# EAGLE schematic STM32H750VBT6_ultra (EAGLE 9.6.2)

## Sheet 1 of 6: STM32H750VBT6_ultra
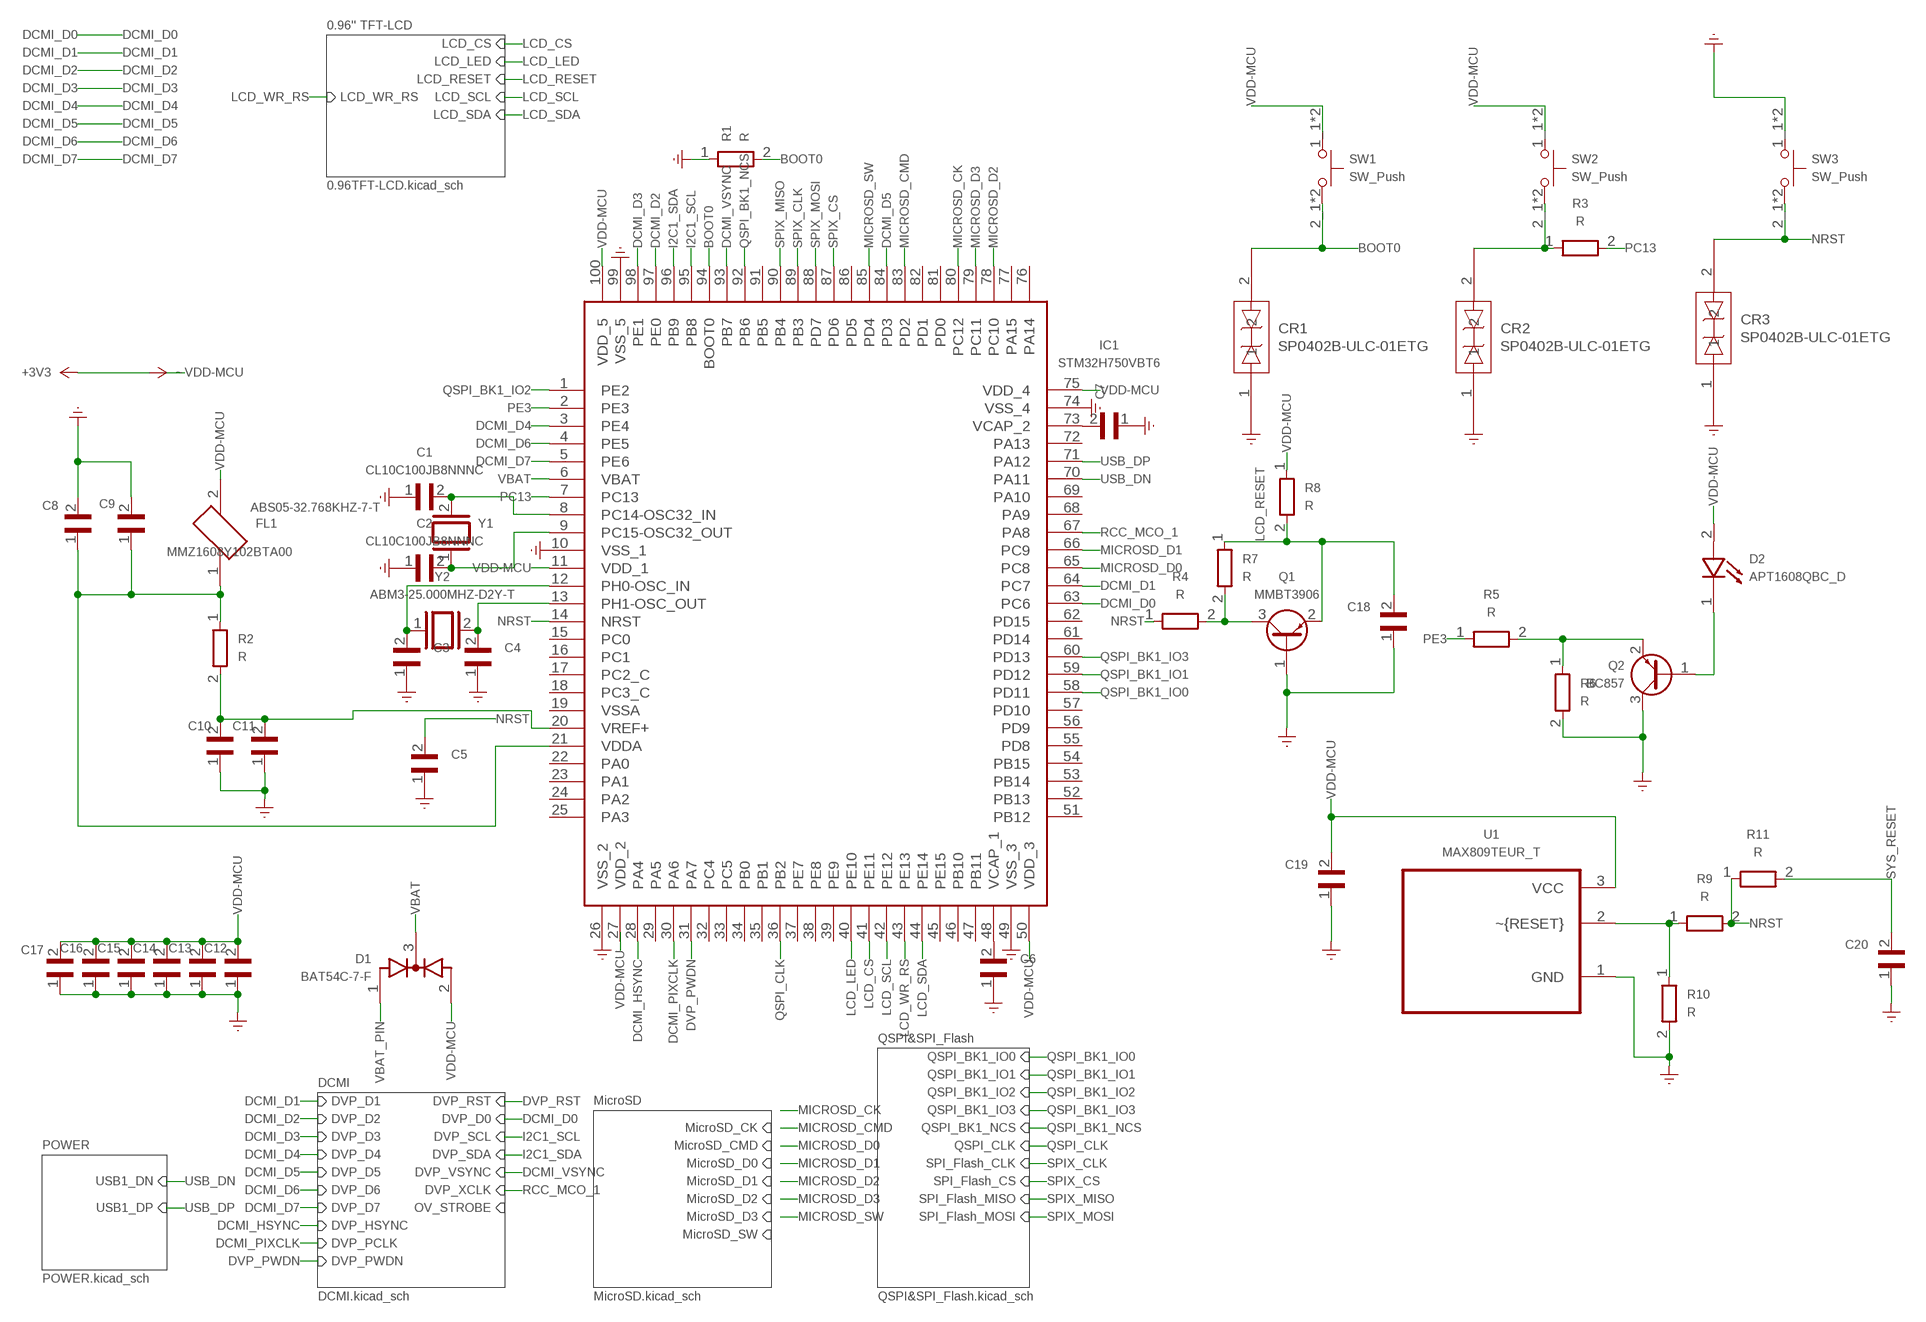
[diagram p0: schematic, sheet 1]

### Parts
C1  CL10C100JB8NNNC  CL10C100JB8NNNCCAPACITOR_SMD_C_0201_0603METRIC  [CAPACITOR_SMD_C_0201_0603METRIC]
C2  CL10C100JB8NNNC  CL10C100JB8NNNCCAPACITOR_SMD_C_0201_0603METRIC  [CAPACITOR_SMD_C_0201_0603METRIC]
C3  CL10C100JB8NNNC  CL10C100JB8NNNCCAPACITOR_SMD_C_0201_0603METRIC  [CAPACITOR_SMD_C_0201_0603METRIC]
C4  CL10C100JB8NNNC  CL10C100JB8NNNCCAPACITOR_SMD_C_0201_0603METRIC  [CAPACITOR_SMD_C_0201_0603METRIC]
C5  CL10C100JB8NNNC  CL10C100JB8NNNCCAPACITOR_SMD_C_0201_0603METRIC  [CAPACITOR_SMD_C_0201_0603METRIC]
C6  CL10C100JB8NNNC  CL10C100JB8NNNCCAPACITOR_SMD_C_0201_0603METRIC  [CAPACITOR_SMD_C_0201_0603METRIC]
C7  CL10C100JB8NNNC  CL10C100JB8NNNCCAPACITOR_SMD_C_0201_0603METRIC  [CAPACITOR_SMD_C_0201_0603METRIC]
C8  CL10C100JB8NNNC  CL10C100JB8NNNCCAPACITOR_SMD_C_0201_0603METRIC  [CAPACITOR_SMD_C_0201_0603METRIC]
C9  CL10C100JB8NNNC  CL10C100JB8NNNCCAPACITOR_SMD_C_0201_0603METRIC  [CAPACITOR_SMD_C_0201_0603METRIC]
C10  CL10C100JB8NNNC  CL10C100JB8NNNCCAPACITOR_SMD_C_0201_0603METRIC  [CAPACITOR_SMD_C_0201_0603METRIC]
C11  CL10C100JB8NNNC  CL10C100JB8NNNCCAPACITOR_SMD_C_0201_0603METRIC  [CAPACITOR_SMD_C_0201_0603METRIC]
C12  CL10C100JB8NNNC  CL10C100JB8NNNCCAPACITOR_SMD_C_0201_0603METRIC  [CAPACITOR_SMD_C_0201_0603METRIC]
C13  CL10C100JB8NNNC  CL10C100JB8NNNCCAPACITOR_SMD_C_0201_0603METRIC  [CAPACITOR_SMD_C_0201_0603METRIC]
C14  CL10C100JB8NNNC  CL10C100JB8NNNCCAPACITOR_SMD_C_0201_0603METRIC  [CAPACITOR_SMD_C_0201_0603METRIC]
C15  CL10C100JB8NNNC  CL10C100JB8NNNCCAPACITOR_SMD_C_0201_0603METRIC  [CAPACITOR_SMD_C_0201_0603METRIC]
C16  CL10C100JB8NNNC  CL10C100JB8NNNCCAPACITOR_SMD_C_0201_0603METRIC  [CAPACITOR_SMD_C_0201_0603METRIC]
C17  CL10C100JB8NNNC  CL10C100JB8NNNCCAPACITOR_SMD_C_0201_0603METRIC  [CAPACITOR_SMD_C_0201_0603METRIC]
C18  CL10C100JB8NNNC  CL10C100JB8NNNCCAPACITOR_SMD_C_0201_0603METRIC_V1  [CAPACITOR_SMD_C_0201_0603METRIC_V1]
C19  CL10C100JB8NNNC  CL10C100JB8NNNCCAPACITOR_SMD_C_0201_0603METRIC  [CAPACITOR_SMD_C_0201_0603METRIC]
C20  CL10C100JB8NNNC  CL10C100JB8NNNCCAPACITOR_SMD_C_0201_0603METRIC  [CAPACITOR_SMD_C_0201_0603METRIC]
CR1  SP0402B-ULC-01ETG  SP0402B-ULC-01ETGFOOTPRINTS_SP0402_LTF_V1  [FOOTPRINTS_SP0402_LTF_V1]
CR2  SP0402B-ULC-01ETG  SP0402B-ULC-01ETGFOOTPRINTS_SP0402_LTF_V1  [FOOTPRINTS_SP0402_LTF_V1]
CR3  SP0402B-ULC-01ETG  SP0402B-ULC-01ETGFOOTPRINTS_SP0402_LTF_V1  [FOOTPRINTS_SP0402_LTF_V1]
D1  BAT54C-7-F  BAT54C-7-FPACKAGE_TO_SOT_SMD_SOT-23_HANDSOLDERING  [PACKAGE_TO_SOT_SMD_SOT-23_HANDSOLDERING]
D2  APT1608QBC_D  APT1608QBC_DLED_SMD_LED_0201_0603METRIC  [LED_SMD_LED_0201_0603METRIC]
FL1  MMZ1608Y102BTA00  MMZ1608Y102BTA00INDUCTOR_SMD_L_0603_1608METRIC  [INDUCTOR_SMD_L_0603_1608METRIC]
IC1  STM32H750VBT6  STM32H750VBT6PACKAGE_QFP_LQFP-100_14X14MM_P0.5MM  [PACKAGE_QFP_LQFP-100_14X14MM_P0.5MM]
Q1  MMBT3906  MMBT3906PACKAGE_TO_SOT_SMD_SOT-23  [PACKAGE_TO_SOT_SMD_SOT-23]
Q2  BC857  BC857PACKAGE_TO_SOT_SMD_SOT-23  [PACKAGE_TO_SOT_SMD_SOT-23]
R1  R  RRESISTOR_SMD_R_0201_0603METRIC  [RESISTOR_SMD_R_0201_0603METRIC]
R2  R  RRESISTOR_SMD_R_0201_0603METRIC  [RESISTOR_SMD_R_0201_0603METRIC]
R3  R  RRESISTOR_SMD_R_0201_0603METRIC_V1  [RESISTOR_SMD_R_0201_0603METRIC_V1]
R4  R  RRESISTOR_SMD_R_0201_0603METRIC  [RESISTOR_SMD_R_0201_0603METRIC]
R5  R  RRESISTOR_SMD_R_0201_0603METRIC  [RESISTOR_SMD_R_0201_0603METRIC]
R6  R  RRESISTOR_SMD_R_0201_0603METRIC  [RESISTOR_SMD_R_0201_0603METRIC]
R7  R  RRESISTOR_SMD_R_0201_0603METRIC  [RESISTOR_SMD_R_0201_0603METRIC]
R8  R  RRESISTOR_SMD_R_0201_0603METRIC  [RESISTOR_SMD_R_0201_0603METRIC]
R9  R  RRESISTOR_SMD_R_0201_0603METRIC  [RESISTOR_SMD_R_0201_0603METRIC]
R10  R  RRESISTOR_SMD_R_0201_0603METRIC  [RESISTOR_SMD_R_0201_0603METRIC]
R11  R  RRESISTOR_SMD_R_0201_0603METRIC  [RESISTOR_SMD_R_0201_0603METRIC]
SW1  SW_Push  SW_PUSHBUTTON_SWITCH_SMD_SW_SPST_EVQP7C  [BUTTON_SWITCH_SMD_SW_SPST_EVQP7C]
SW2  SW_Push  SW_PUSHBUTTON_SWITCH_SMD_SW_SPST_EVQP7C  [BUTTON_SWITCH_SMD_SW_SPST_EVQP7C]
SW3  SW_Push  SW_PUSHBUTTON_SWITCH_SMD_SW_SPST_EVQP7C  [BUTTON_SWITCH_SMD_SW_SPST_EVQP7C]
U1  MAX809TEUR_T  MAX809TEUR_TPACKAGE_TO_SOT_SMD_SOT-23-3  [PACKAGE_TO_SOT_SMD_SOT-23-3]
Y1  ABS05-32.768KHZ-7-T  ABS05-32.768KHZ-7-TCRYSTAL_CRYSTAL_SMD_3215-2PIN_3.2X1.5MM  [CRYSTAL_CRYSTAL_SMD_3215-2PIN_3.2X1.5MM]
Y2  ABM3-25.000MHZ-D2Y-T  ABM3-25.000MHZ-D2Y-TCRYSTAL_CRYSTAL_SMD_3215-2PIN_3.2X1.5MM  [CRYSTAL_CRYSTAL_SMD_3215-2PIN_3.2X1.5MM]

### Nets
BOOT0: CR1.2 IC1.94(BOOT0) R1.2(~) SW1.2_1 SW1.2_2
DCMI_D0: IC1.63(PC6) ; also sheet 3
DCMI_D1: IC1.64(PC7) ; also sheet 3
DCMI_D2: IC1.97(PE0) ; also sheet 3
DCMI_D3: IC1.98(PE1) ; also sheet 3
DCMI_D4: IC1.3(PE4) ; also sheet 3
DCMI_D5: IC1.84(PD3) ; also sheet 3
DCMI_D6: IC1.4(PE5) ; also sheet 3
DCMI_D7: IC1.5(PE6) ; also sheet 3
DCMI_HSYNC: IC1.28(PA4) ; also sheet 3
DCMI_PIXCLK: IC1.30(PA6) ; also sheet 3
DCMI_VSYNC: IC1.93(PB7) ; also sheet 3
DVP_PWDN: IC1.31(PA7) ; also sheet 3
EARTH: C1.1(~) C2.1(~) C3.1(~) C4.1(~) C5.1(~) C6.1(~) C7.1(~) C8.2(~) C9.2(~) C10.1(~) C11.1(~) C12.1(~) C13.1(~) C14.1(~) C15.1(~) C16.1(~) C17.1(~) C18.1(~) C19.1(~) C20.1(~) CR1.1 CR2.1 CR3.1 IC1.10(VSS_1) IC1.26(VSS_2) IC1.49(VSS_3) IC1.74(VSS_4) IC1.99(VSS_5) Q1.1(B) Q2.3(C) R1.1(~) R6.2(~) R10.2(~) SW3.1_1 SW3.1_2 U1.1(GND) ; supply symbol labelled Earth ; also sheet 2,3,4,5,6
I2C1_SCL: IC1.95(PB8) ; also sheet 3
I2C1_SDA: IC1.96(PB9) ; also sheet 3
LCD_CS: IC1.41(PE11) ; also sheet 2
LCD_LED: IC1.40(PE10) ; also sheet 2
LCD_RESET: C18.2(~) Q1.2(E) R7.1(~) R8.2(~) ; also sheet 2
LCD_SCL: IC1.42(PE12) ; also sheet 2
LCD_SDA: IC1.44(PE14) ; also sheet 2
LCD_WR_RS: IC1.43(PE13) ; also sheet 2
MICROSD_CK: IC1.80(PC12)
MICROSD_CMD: IC1.83(PD2)
MICROSD_D0: IC1.65(PC8)
MICROSD_D1: IC1.66(PC9)
MICROSD_D2: IC1.78(PC10)
MICROSD_D3: IC1.79(PC11)
MICROSD_SW: IC1.85(PD4)
N$4: Q1.3(C) R4.2(~) R7.2(~)
N$5: C4.2(~) IC1.13(PH1-OSC_OUT) Y2.2(~)
N$8: D2.1(~) Q2.1(B)
N$9: CR2.2 R3.1(~) SW2.2_1 SW2.2_2
N$10: R9.1(~) R10.1(~) U1.2(~{RESET})
N$15: C10.2(~) C11.2(~) IC1.20(VREF+) R2.2(~)
N$27: Q2.2(E) R5.2(~) R6.1(~)
N$28: C2.2(~) IC1.9(PC15-OSC32_OUT) Y1.1(~)
N$29: C1.2(~) IC1.8(PC14-OSC32_IN) Y1.2(~)
N$46: C8.1(~) C9.1(~) FL1.1(~) IC1.21(VDDA) R2.1(~)
N$48: C3.2(~) IC1.12(PH0-OSC_IN) Y2.1(~)
N$55: C7.2(~) IC1.73(VCAP_2)
N$56: C6.2(~) IC1.48(VCAP_1)
NRST: C5.2(~) CR3.2 IC1.14(NRST) R4.1(~) R9.2(~) R11.1(~) SW3.2_1 SW3.2_2
PC13: IC1.7(PC13) R3.2(~)
PE3: IC1.2(PE3) R5.1(~)
QSPI_BK1_IO0: IC1.58(PD11) ; also sheet 6
QSPI_BK1_IO1: IC1.59(PD12) ; also sheet 6
QSPI_BK1_IO2: IC1.1(PE2) ; also sheet 6
QSPI_BK1_IO3: IC1.60(PD13) ; also sheet 6
QSPI_BK1_NCS: IC1.92(PB6) ; also sheet 6
QSPI_CLK: IC1.36(PB2) ; also sheet 6
RCC_MCO_1: IC1.67(PA8) ; also sheet 3
SPIX_CLK: IC1.89(PB3) ; also sheet 6
SPIX_CS: IC1.87(PD6) ; also sheet 6
SPIX_MISO: IC1.90(PB4) ; also sheet 6
SPIX_MOSI: IC1.88(PD7) ; also sheet 6
SYS_RESET: C20.2(~) R11.2(~)
USB_DN: IC1.70(PA11) ; also sheet 5
USB_DP: IC1.71(PA12) ; also sheet 5
VBAT: D1.3(~) IC1.6(VBAT)
VBAT_PIN: D1.1(~)
VDD-MCU: C12.2(~) C13.2(~) C14.2(~) C15.2(~) C16.2(~) C17.2(~) C19.2(~) D1.2(~) D2.2(~) FL1.2(~) IC1.11(VDD_1) IC1.27(VDD_2) IC1.50(VDD_3) IC1.75(VDD_4) IC1.100(VDD_5) R8.1(~) SW1.1_1 SW1.1_2 SW2.1_1 SW2.1_2 U1.3(VCC)
Unconnected: IC1.15(PC0) IC1.16(PC1) IC1.17(PC2_C) IC1.18(PC3_C) IC1.19(VSSA) IC1.22(PA0) IC1.23(PA1) IC1.24(PA2) IC1.25(PA3) IC1.29(PA5) IC1.32(PC4) IC1.33(PC5) IC1.34(PB0) IC1.35(PB1) IC1.37(PE7) IC1.38(PE8) IC1.39(PE9) IC1.45(PE15) IC1.46(PB10) IC1.47(PB11) IC1.51(PB12) IC1.52(PB13) IC1.53(PB14) IC1.54(PB15) IC1.55(PD8) IC1.56(PD9) IC1.57(PD10) IC1.61(PD14) IC1.62(PD15) IC1.68(PA9) IC1.69(PA10) IC1.72(PA13) IC1.76(PA14) IC1.77(PA15) IC1.81(PD0) IC1.82(PD1) IC1.86(PD5) IC1.91(PB5)

### Notes on the sheet
- 0.96'' TFT-LCD
- LCD_CS
- LCD_LED
- LCD_RESET
- LCD_WR_RS | LCD_SCL
- LCD_SDA
- 0.96TFT-LCD.kicad_sch
- QSPI&SPI_Flash
- QSPI_BK1_IO0
- QSPI_BK1_IO1
- DCMI
- QSPI_BK1_IO2
- DVP_D1 | DVP_RST
- MicroSD
- QSPI_BK1_IO3
- DVP_D2 | DVP_D0
- MicroSD_CK | QSPI_BK1_NCS
- DVP_D3 | DVP_SCL
- MicroSD_CMD | QSPI_CLK
- POWER
- DVP_D4 | DVP_SDA
- MicroSD_D0 | SPI_Flash_CLK
- DVP_D5 | DVP_VSYNC
- USB1_DN | MicroSD_D1 | SPI_Flash_CS
- DVP_D6 | DVP_XCLK
- MicroSD_D2 | SPI_Flash_MISO
- USB1_DP | DVP_D7 | OV_STROBE
- MicroSD_D3 | SPI_Flash_MOSI
- DVP_HSYNC
- MicroSD_SW
- DVP_PCLK
- DVP_PWDN
- POWER.kicad_sch
- DCMI.kicad_sch | MicroSD.kicad_sch | QSPI&SPI_Flash.kicad_sch

## Sheet 2 of 6: 0.96''_TFT-LCD:0.96TFT-LCD
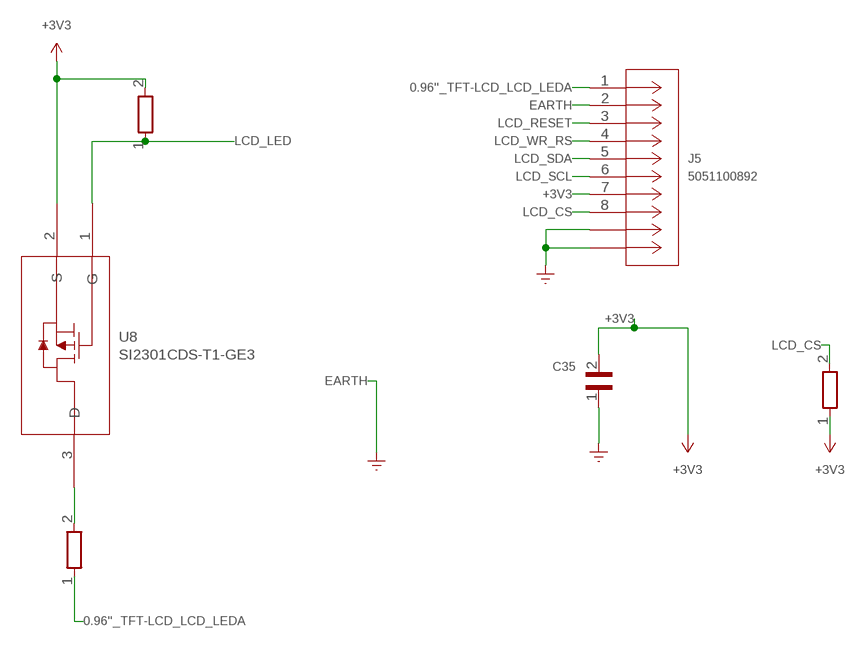
[diagram p1: schematic, sheet 2]

### Parts
C35  CL10C100JB8NNNC  CL10C100JB8NNNCCAPACITOR_SMD_C_0201_0603METRIC  [CAPACITOR_SMD_C_0201_0603METRIC]
J5  5051100892  5051100892CONNECTOR_FFC-FPC_HIROSE_FH12-8S-0.5SH_1X08-1MP_P0.50MM_HORIZONTAL  [CONNECTOR_FFC-FPC_HIROSE_FH12-8S-0.5SH_1X08-1MP_P0.50MM_HORIZONTAL]
R40  R  RRESISTOR_SMD_R_0201_0603METRIC  [RESISTOR_SMD_R_0201_0603METRIC]
R41  R  RRESISTOR_SMD_R_0201_0603METRIC  [RESISTOR_SMD_R_0201_0603METRIC]
R42  R  RRESISTOR_SMD_R_0201_0603METRIC  [RESISTOR_SMD_R_0201_0603METRIC]
U8  SI2301CDS-T1-GE3  SI2301CDS-T1-GE3PACKAGE_TO_SOT_SMD_SOT-23  [PACKAGE_TO_SOT_SMD_SOT-23]

### Nets
0.96''_TFT-LCD_LCD_LEDA: J5.1(~) R42.1(~)
+3V3: C35.2(~) J5.7(~) R40.1(~) R41.2(~) U8.2(S) ; also sheet 1,3,4,6
EARTH: C35.1(~) J5.2(~) J5.~ ; supply symbol labelled Earth ; also sheet 1,3,4,5,6
LCD_CS: J5.8(~) R40.2(~) ; also sheet 1
LCD_LED: R41.1(~) U8.1(G) ; also sheet 1
LCD_RESET: J5.3(~) ; also sheet 1
LCD_SCL: J5.6(~) ; also sheet 1
LCD_SDA: J5.5(~) ; also sheet 1
LCD_WR_RS: J5.4(~) ; also sheet 1
N$66: R42.2(~) U8.3(D)

## Sheet 3 of 6: DCMI:DCMI
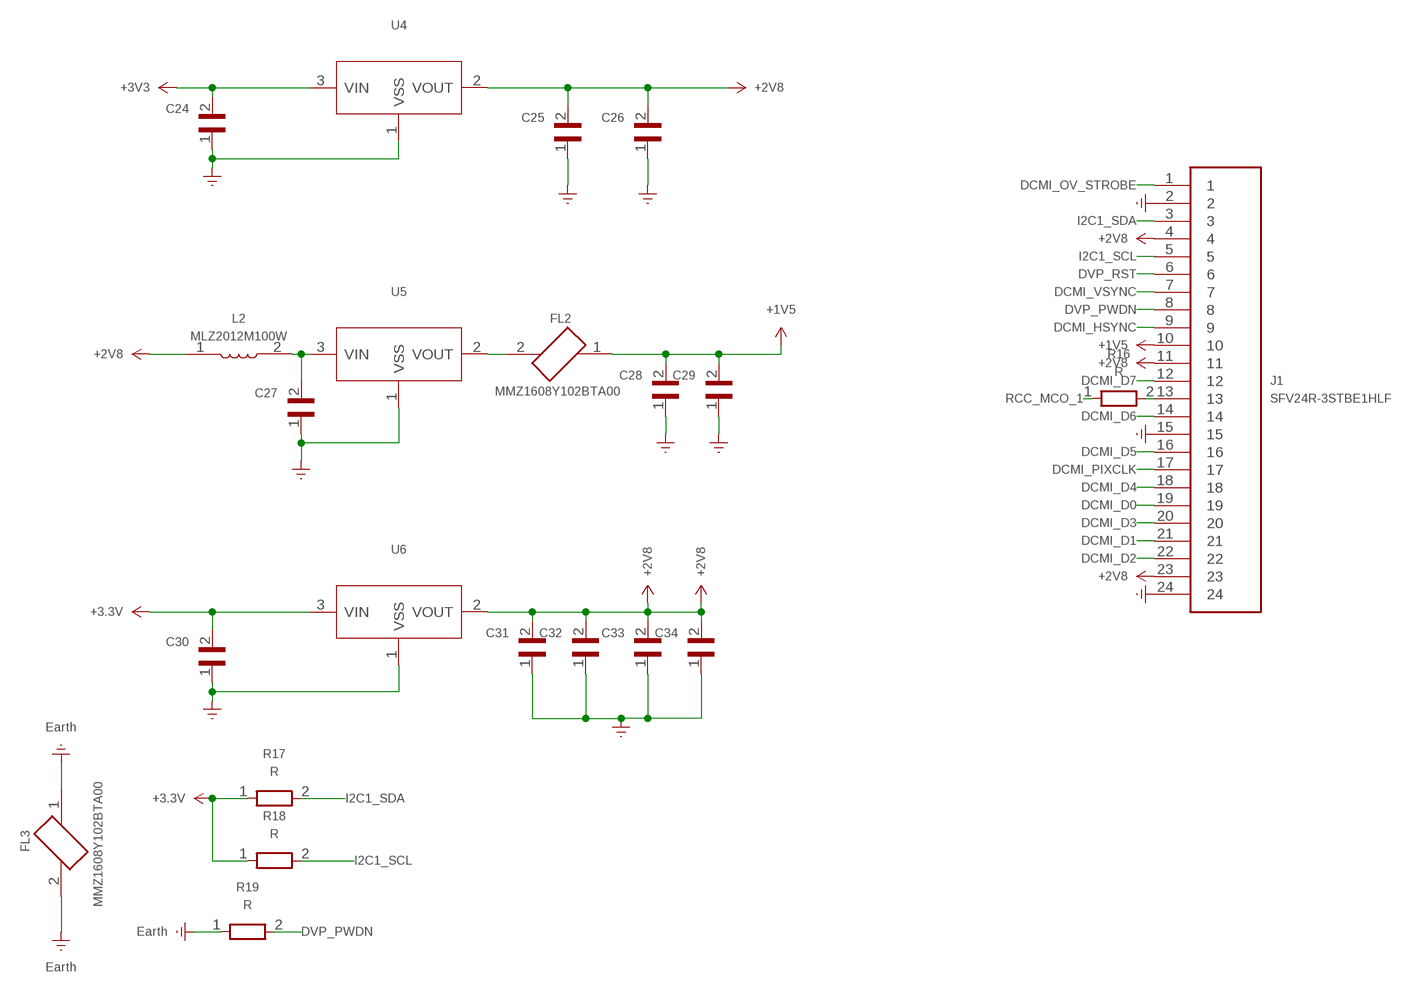
[diagram p2: schematic, sheet 3]

### Parts
C24  CL10C100JB8NNNC  CL10C100JB8NNNCCAPACITOR_SMD_C_0201_0603METRIC  [CAPACITOR_SMD_C_0201_0603METRIC]
C25  CL10C100JB8NNNC  CL10C100JB8NNNCCAPACITOR_SMD_C_0201_0603METRIC  [CAPACITOR_SMD_C_0201_0603METRIC]
C26  CL10C100JB8NNNC  CL10C100JB8NNNCCAPACITOR_SMD_C_0201_0603METRIC  [CAPACITOR_SMD_C_0201_0603METRIC]
C27  CL10C100JB8NNNC  CL10C100JB8NNNCCAPACITOR_SMD_C_0201_0603METRIC  [CAPACITOR_SMD_C_0201_0603METRIC]
C28  CL10C100JB8NNNC  CL10C100JB8NNNCCAPACITOR_SMD_C_0201_0603METRIC  [CAPACITOR_SMD_C_0201_0603METRIC]
C29  CL10C100JB8NNNC  CL10C100JB8NNNCCAPACITOR_SMD_C_0201_0603METRIC  [CAPACITOR_SMD_C_0201_0603METRIC]
C30  CL10C100JB8NNNC  CL10C100JB8NNNCCAPACITOR_SMD_C_0201_0603METRIC  [CAPACITOR_SMD_C_0201_0603METRIC]
C31  CL10C100JB8NNNC  CL10C100JB8NNNCCAPACITOR_SMD_C_0201_0603METRIC  [CAPACITOR_SMD_C_0201_0603METRIC]
C32  CL10C100JB8NNNC  CL10C100JB8NNNCCAPACITOR_SMD_C_0201_0603METRIC  [CAPACITOR_SMD_C_0201_0603METRIC]
C33  CL10C100JB8NNNC  CL10C100JB8NNNCCAPACITOR_SMD_C_0201_0603METRIC  [CAPACITOR_SMD_C_0201_0603METRIC]
C34  CL10C100JB8NNNC  CL10C100JB8NNNCCAPACITOR_SMD_C_0201_0603METRIC_V1  [CAPACITOR_SMD_C_0201_0603METRIC_V1]
FL2  MMZ1608Y102BTA00  MMZ1608Y102BTA00INDUCTOR_SMD_L_0603_1608METRIC  [INDUCTOR_SMD_L_0603_1608METRIC]
FL3  MMZ1608Y102BTA00  MMZ1608Y102BTA00INDUCTOR_SMD_L_0603_1608METRIC  [INDUCTOR_SMD_L_0603_1608METRIC]
J1  SFV24R-3STBE1HLF  SFV24R-3STBE1HLFAMPHENOL_SFV24R-3STBE1HLF  [AMPHENOL_SFV24R-3STBE1HLF]
L2  MLZ2012M100W  MLZ2012M100WINDUCTOR_SMD_L_0805_2012METRIC  [INDUCTOR_SMD_L_0805_2012METRIC]
R16  R  RRESISTOR_SMD_R_0201_0603METRIC  [RESISTOR_SMD_R_0201_0603METRIC]
R17  R  RRESISTOR_SMD_R_0201_0603METRIC  [RESISTOR_SMD_R_0201_0603METRIC]
R18  R  RRESISTOR_SMD_R_0201_0603METRIC  [RESISTOR_SMD_R_0201_0603METRIC]
R19  R  RRESISTOR_SMD_R_0201_0603METRIC  [RESISTOR_SMD_R_0201_0603METRIC]
U4  PMIC-LDO-XC6206P332MR-G_SOT23_  PMIC-LDO-XC6206P332MR-G_SOT23_PACKAGE_TO_SOT_SMD_SOT-23-3_V1  [PACKAGE_TO_SOT_SMD_SOT-23-3_V1]
U5  PMIC-LDO-XC6206P332MR-G_SOT23_  PMIC-LDO-XC6206P332MR-G_SOT23_PACKAGE_TO_SOT_SMD_SOT-23-3_V1  [PACKAGE_TO_SOT_SMD_SOT-23-3_V1]
U6  PMIC-LDO-XC6206P332MR-G_SOT23_  PMIC-LDO-XC6206P332MR-G_SOT23_PACKAGE_TO_SOT_SMD_SOT-23-3_V1  [PACKAGE_TO_SOT_SMD_SOT-23-3_V1]

### Nets
+1V5: C28.2(~) C29.2(~) FL2.1(~) J1.10
+2V8: C25.2(~) C26.2(~) C31.2(~) C32.2(~) C33.2(~) C34.2(~) J1.4 J1.11 J1.23 L2.1(~) U4.2(VOUT) U6.2(VOUT)
+3.3V: C30.2(~) R17.1(~) R18.1(~) U6.3(VIN) ; also sheet 5
+3V3: C24.2(~) U4.3(VIN) ; also sheet 1,2,4,6
DCMI_D0: J1.19 ; also sheet 1
DCMI_D1: J1.21 ; also sheet 1
DCMI_D2: J1.22 ; also sheet 1
DCMI_D3: J1.20 ; also sheet 1
DCMI_D4: J1.18 ; also sheet 1
DCMI_D5: J1.16 ; also sheet 1
DCMI_D6: J1.14 ; also sheet 1
DCMI_D7: J1.12 ; also sheet 1
DCMI_HSYNC: J1.9 ; also sheet 1
DCMI_OV_STROBE: J1.1
DCMI_PIXCLK: J1.17 ; also sheet 1
DCMI_VSYNC: J1.7 ; also sheet 1
DVP_PWDN: J1.8 R19.2(~) ; also sheet 1
DVP_RST: J1.6 ; also sheet 1
EARTH: C24.1(~) C25.1(~) C26.1(~) C27.1(~) C28.1(~) C29.1(~) C30.1(~) C31.1(~) C32.1(~) C33.1(~) C34.1(~) FL3.1(~) FL3.2(~) J1.2 J1.15 J1.24 R19.1(~) U4.1(VSS) U5.1(VSS) U6.1(VSS) ; supply symbol labelled Earth ; also sheet 1,2,4,5,6
I2C1_SCL: J1.5 R18.2(~) ; also sheet 1
I2C1_SDA: J1.3 R17.2(~) ; also sheet 1
N$73: C27.2(~) L2.2(~) U5.3(VIN)
N$91: FL2.2(~) U5.2(VOUT)
N$97: J1.13 R16.2(~)
RCC_MCO_1: R16.1(~) ; also sheet 1

## Sheet 4 of 6: MICROSD:MICROSD
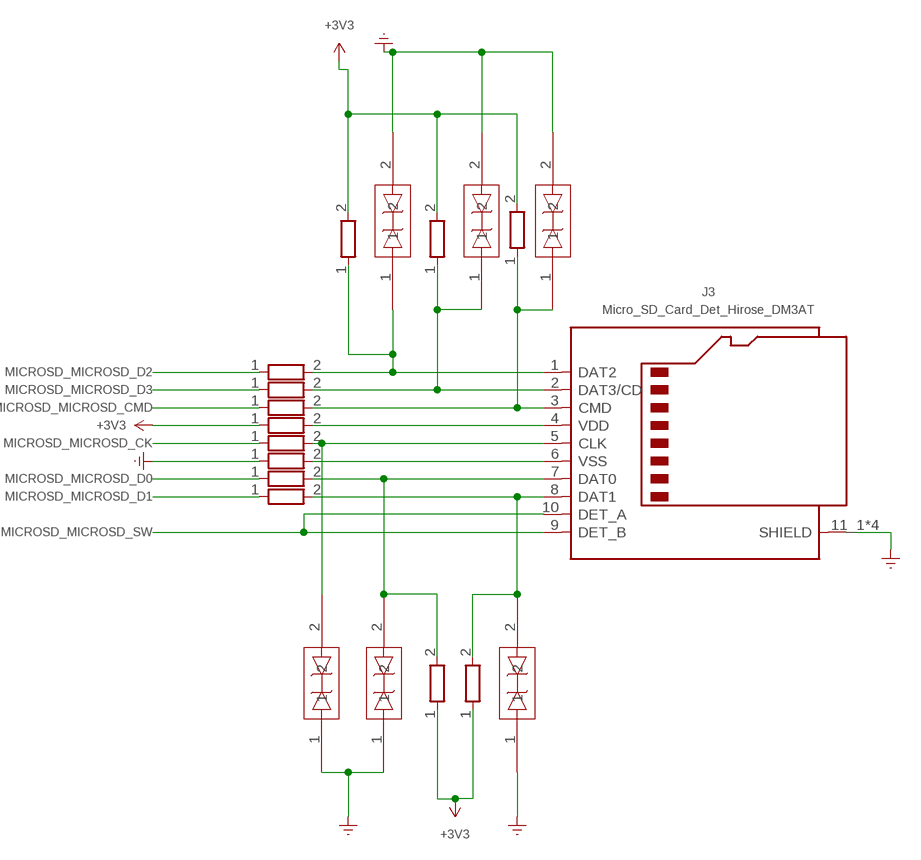
[diagram p3: schematic, sheet 4]

### Parts
CR8  SP0402B-ULC-01ETG  SP0402B-ULC-01ETGFOOTPRINTS_SP0402_LTF  [FOOTPRINTS_SP0402_LTF]
CR9  SP0402B-ULC-01ETG  SP0402B-ULC-01ETGFOOTPRINTS_SP0402_LTF  [FOOTPRINTS_SP0402_LTF]
CR10  SP0402B-ULC-01ETG  SP0402B-ULC-01ETGFOOTPRINTS_SP0402_LTF  [FOOTPRINTS_SP0402_LTF]
CR11  SP0402B-ULC-01ETG  SP0402B-ULC-01ETGFOOTPRINTS_SP0402_LTF  [FOOTPRINTS_SP0402_LTF]
CR12  SP0402B-ULC-01ETG  SP0402B-ULC-01ETGFOOTPRINTS_SP0402_LTF  [FOOTPRINTS_SP0402_LTF]
CR13  SP0402B-ULC-01ETG  SP0402B-ULC-01ETGFOOTPRINTS_SP0402_LTF  [FOOTPRINTS_SP0402_LTF]
J3  Micro_SD_Card_Det_Hirose_DM3AT  MICRO_SD_CARD_DET_HIROSE_DM3ATCONNECTOR_CARD_MICROSD_HC_HIROSE_DM3AT-SF-PEJM5  [CONNECTOR_CARD_MICROSD_HC_HIROSE_DM3AT-SF-PEJM5]
R20  R  RRESISTOR_SMD_R_0201_0603METRIC  [RESISTOR_SMD_R_0201_0603METRIC]
R21  R  RRESISTOR_SMD_R_0201_0603METRIC  [RESISTOR_SMD_R_0201_0603METRIC]
R22  R  RRESISTOR_SMD_R_0201_0603METRIC  [RESISTOR_SMD_R_0201_0603METRIC]
R23  R  RRESISTOR_SMD_R_0201_0603METRIC  [RESISTOR_SMD_R_0201_0603METRIC]
R24  R  RRESISTOR_SMD_R_0201_0603METRIC  [RESISTOR_SMD_R_0201_0603METRIC]
R25  R  RRESISTOR_SMD_R_0201_0603METRIC  [RESISTOR_SMD_R_0201_0603METRIC]
R26  R  RRESISTOR_SMD_R_0201_0603METRIC  [RESISTOR_SMD_R_0201_0603METRIC]
R27  R  RRESISTOR_SMD_R_0201_0603METRIC  [RESISTOR_SMD_R_0201_0603METRIC]
R28  R  RRESISTOR_SMD_R_0201_0603METRIC  [RESISTOR_SMD_R_0201_0603METRIC]
R29  R  RRESISTOR_SMD_R_0201_0603METRIC  [RESISTOR_SMD_R_0201_0603METRIC]
R30  R  RRESISTOR_SMD_R_0201_0603METRIC  [RESISTOR_SMD_R_0201_0603METRIC]
R31  R  RRESISTOR_SMD_R_0201_0603METRIC  [RESISTOR_SMD_R_0201_0603METRIC]
R32  R  RRESISTOR_SMD_R_0201_0603METRIC  [RESISTOR_SMD_R_0201_0603METRIC]

### Nets
+3V3: R23.1(~) R28.2(~) R29.2(~) R30.2(~) R31.1(~) R32.1(~) ; also sheet 1,2,3,6
EARTH: CR8.2 CR9.2 CR10.2 CR11.1 CR12.1 CR13.1 J3.11_1(SHIELD) J3.11_2(SHIELD) J3.11_3(SHIELD) J3.11_4(SHIELD) R25.1(~) ; supply symbol labelled Earth ; also sheet 1,2,3,5,6
MICROSD_MICROSD_CK: R24.1(~)
MICROSD_MICROSD_CMD: R22.1(~)
MICROSD_MICROSD_D0: R26.1(~)
MICROSD_MICROSD_D1: R27.1(~)
MICROSD_MICROSD_D2: R20.1(~)
MICROSD_MICROSD_D3: R21.1(~)
MICROSD_MICROSD_SW: J3.9(DET_B) J3.10(DET_A)
N$103: J3.4(VDD) R23.2(~)
N$110: CR10.1 J3.3(CMD) R22.2(~) R30.1(~)
N$111: CR8.1 J3.1(DAT2) R20.2(~) R28.1(~)
N$112: CR9.1 J3.2(DAT3/CD) R21.2(~) R29.1(~)
N$115: CR12.2 J3.7(DAT0) R26.2(~) R31.2(~)
N$120: CR11.2 J3.5(CLK) R24.2(~)
N$130: J3.6(VSS) R25.2(~)
N$133: CR13.2 J3.8(DAT1) R27.2(~) R32.2(~)

## Sheet 5 of 6: POWER:POWER
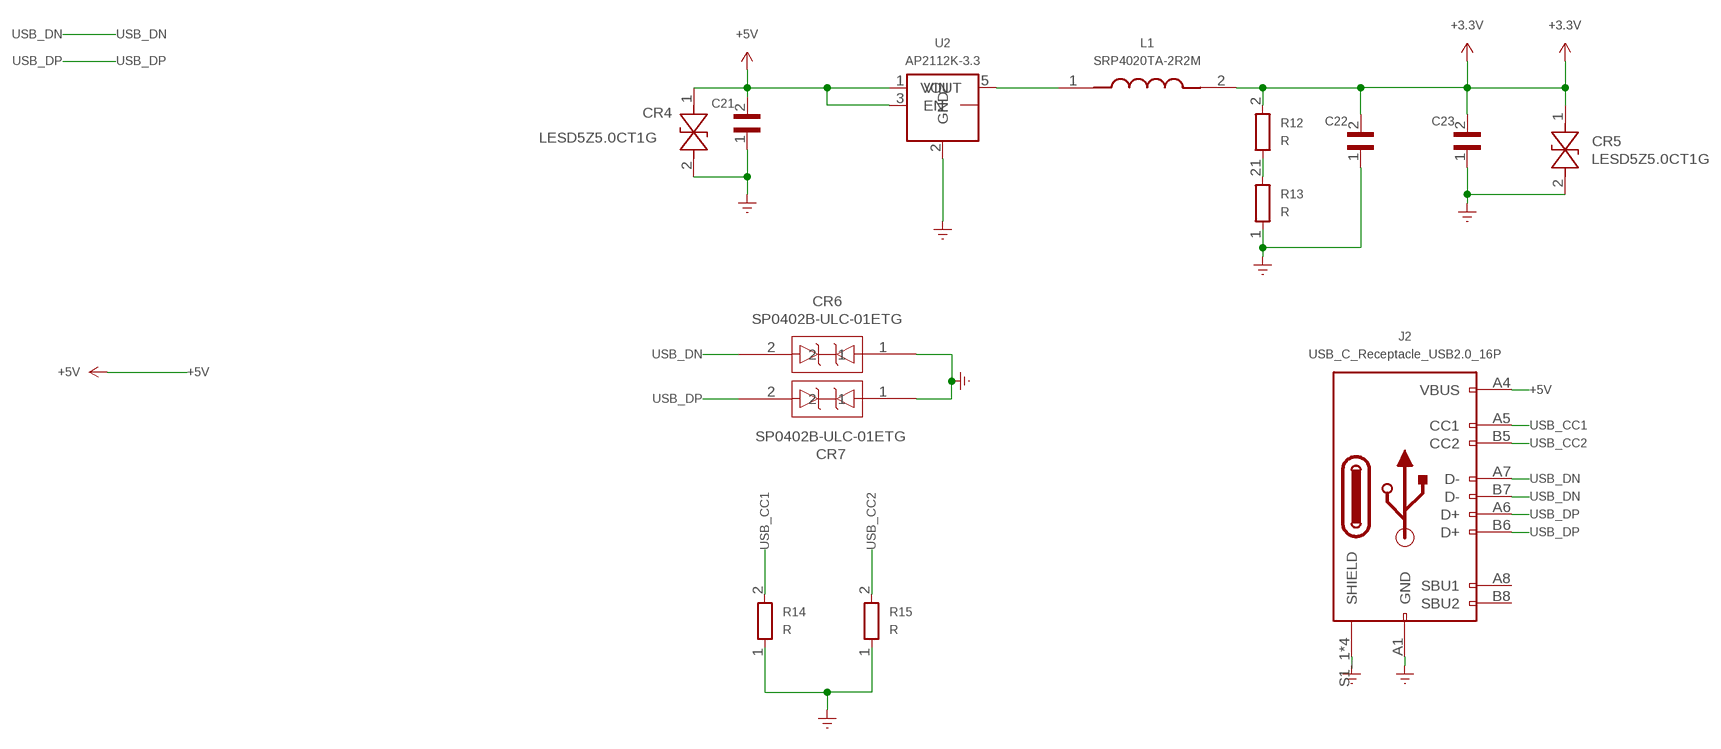
[diagram p4: schematic, sheet 5]

### Parts
C21  CL10C100JB8NNNC  CL10C100JB8NNNCCAPACITOR_SMD_C_0201_0603METRIC  [CAPACITOR_SMD_C_0201_0603METRIC]
C22  CL10C100JB8NNNC  CL10C100JB8NNNCCAPACITOR_SMD_C_0201_0603METRIC  [CAPACITOR_SMD_C_0201_0603METRIC]
C23  CL10C100JB8NNNC  CL10C100JB8NNNCCAPACITOR_SMD_C_0201_0603METRIC  [CAPACITOR_SMD_C_0201_0603METRIC]
CR4  LESD5Z5.0CT1G  LESD5Z5.0CT1GDIODE_SMD_D_SOD-523_V1  [DIODE_SMD_D_SOD-523_V1]
CR5  LESD5Z5.0CT1G  LESD5Z5.0CT1GDIODE_SMD_D_SOD-523  [DIODE_SMD_D_SOD-523]
CR6  SP0402B-ULC-01ETG  SP0402B-ULC-01ETGFOOTPRINTS_SP0402_LTF_V1  [FOOTPRINTS_SP0402_LTF_V1]
CR7  SP0402B-ULC-01ETG  SP0402B-ULC-01ETGFOOTPRINTS_SP0402_LTF_V1  [FOOTPRINTS_SP0402_LTF_V1]
J2  USB_C_Receptacle_USB2.0_16P  USB_C_RECEPTACLE_USB2.0_16PCONNECTOR_USB_USB_C_RECEPTACLE_GCT_USB4110  [CONNECTOR_USB_USB_C_RECEPTACLE_GCT_USB4110]
L1  SRP4020TA-2R2M  SRP4020TA-2R2MINDUCTOR_SMD_L_COILCRAFT_XXL4020  [INDUCTOR_SMD_L_COILCRAFT_XXL4020]
R12  R  RRESISTOR_SMD_R_0201_0603METRIC  [RESISTOR_SMD_R_0201_0603METRIC]
R13  R  RRESISTOR_SMD_R_0201_0603METRIC  [RESISTOR_SMD_R_0201_0603METRIC]
R14  R  RRESISTOR_SMD_R_0201_0603METRIC  [RESISTOR_SMD_R_0201_0603METRIC]
R15  R  RRESISTOR_SMD_R_0201_0603METRIC  [RESISTOR_SMD_R_0201_0603METRIC]
U2  AP2112K-3.3  AP2112K-3.3PACKAGE_TO_SOT_SMD_SOT-23-5  [PACKAGE_TO_SOT_SMD_SOT-23-5]

### Nets
+3.3V: C22.2(~) C23.2(~) CR5.1 L1.2(~) R12.2(~) ; also sheet 3
+5V: C21.2(~) CR4.1 J2.A4(VBUS) J2.A9(VBUS) J2.B4(VBUS) J2.B9(VBUS) U2.1(VIN) U2.3(EN)
EARTH: C21.1(~) C22.1(~) C23.1(~) CR4.2 CR5.2 CR6.1 CR7.1 J2.A1(GND) J2.A12(GND) J2.B1(GND) J2.B12(GND) J2.S1_1(SHIELD) J2.S1_2(SHIELD) J2.S1_3(SHIELD) J2.S1_4(SHIELD) R13.1(~) R14.1(~) R15.1(~) U2.2(GND) ; supply symbol labelled Earth ; also sheet 1,2,3,4,6
N$144: L1.1(~) U2.5(VOUT)
N$157: R12.1(~) R13.2(~)
USB_CC1: J2.A5(CC1) R14.2(~)
USB_CC2: J2.B5(CC2) R15.2(~)
USB_DN: CR6.2 J2.A7(D-) J2.B7(D-) ; also sheet 1
USB_DP: CR7.2 J2.A6(D+) J2.B6(D+) ; also sheet 1
Unconnected: J2.A8(SBU1) J2.B8(SBU2) U2.4(NC)

## Sheet 6 of 6: QSPI_SPI_FLASH:QSPI_SPI_FLASH
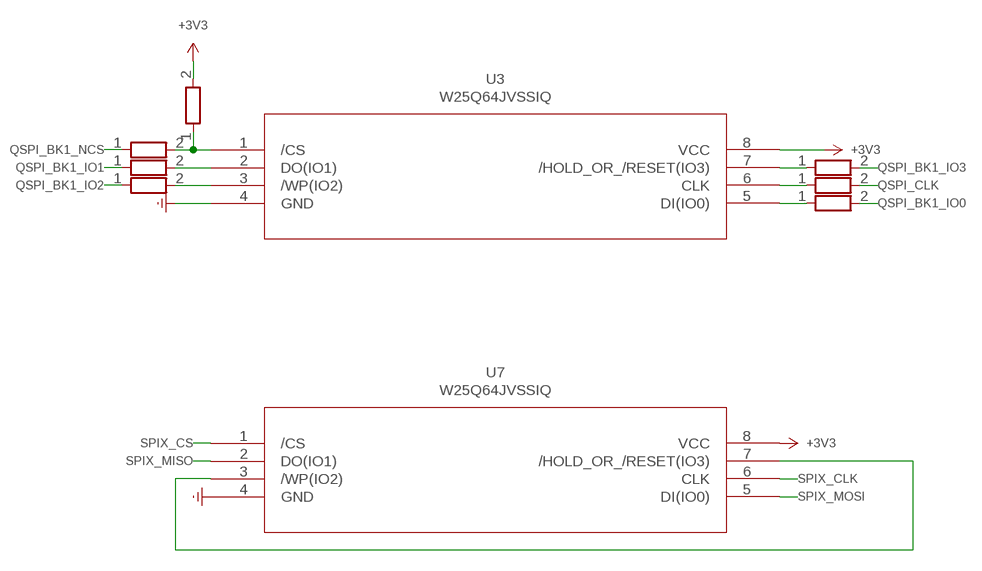
[diagram p5: schematic, sheet 6]

### Parts
R33  R  RRESISTOR_SMD_R_0201_0603METRIC_V1  [RESISTOR_SMD_R_0201_0603METRIC_V1]
R34  R  RRESISTOR_SMD_R_0201_0603METRIC_V1  [RESISTOR_SMD_R_0201_0603METRIC_V1]
R35  R  RRESISTOR_SMD_R_0201_0603METRIC_V1  [RESISTOR_SMD_R_0201_0603METRIC_V1]
R36  R  RRESISTOR_SMD_R_0201_0603METRIC_V1  [RESISTOR_SMD_R_0201_0603METRIC_V1]
R37  R  RRESISTOR_SMD_R_0201_0603METRIC  [RESISTOR_SMD_R_0201_0603METRIC]
R38  R  RRESISTOR_SMD_R_0201_0603METRIC  [RESISTOR_SMD_R_0201_0603METRIC]
R39  R  RRESISTOR_SMD_R_0201_0603METRIC  [RESISTOR_SMD_R_0201_0603METRIC]
U3  W25Q64JVSSIQ  W25Q64JVSSIQPACKAGE_SO_SOIC-8_3.9X4.9MM_P1.27MM  [PACKAGE_SO_SOIC-8_3.9X4.9MM_P1.27MM]
U7  W25Q64JVSSIQ  W25Q64JVSSIQPACKAGE_SO_SOIC-8_3.9X4.9MM_P1.27MM  [PACKAGE_SO_SOIC-8_3.9X4.9MM_P1.27MM]

### Nets
+3V3: R39.2(~) U3.8(VCC) U7.8(VCC) ; also sheet 1,2,3,4
EARTH: U3.4(GND) U7.4(GND) ; supply symbol labelled Earth ; also sheet 1,2,3,4,5
N$161: U7.3(/WP(IO2)) U7.7(/HOLD_OR_/RESET(IO3))
N$162: R35.2(~) U3.3(/WP(IO2))
N$163: R33.2(~) R39.1(~) U3.1(/CS)
N$164: R34.2(~) U3.2(DO(IO1))
N$165: R36.1(~) U3.7(/HOLD_OR_/RESET(IO3))
N$166: R38.1(~) U3.5(DI(IO0))
N$168: R37.1(~) U3.6(CLK)
QSPI_BK1_IO0: R38.2(~) ; also sheet 1
QSPI_BK1_IO1: R34.1(~) ; also sheet 1
QSPI_BK1_IO2: R35.1(~) ; also sheet 1
QSPI_BK1_IO3: R36.2(~) ; also sheet 1
QSPI_BK1_NCS: R33.1(~) ; also sheet 1
QSPI_CLK: R37.2(~) ; also sheet 1
SPIX_CLK: U7.6(CLK) ; also sheet 1
SPIX_CS: U7.1(/CS) ; also sheet 1
SPIX_MISO: U7.2(DO(IO1)) ; also sheet 1
SPIX_MOSI: U7.5(DI(IO0)) ; also sheet 1

## Library data of the parts
C1-C35 = CL10C100JB8NNNC:CL10C100JB8NNNC; AVAILABILITY: In Stock; A_MAX: 0.9; A_MIN: 0.9; A_NOM: 0.9; CHECK_PRICES: https://www.snapeda.com/parts/CL10C100JB8NNNC/Samsung/view-part/?ref=eda; DESCRIPTION_1: 10 pF ±5% 50V Ceramic Capacitor C0G, NP0 0603 (1608 Metric); D_MAX: 1.7; D_MIN: 1.5; D_NOM: 1.6; E_MAX: 0.9; E_MIN: 0.7; E_NOM: 0.8; FOOTPRINT: Capacitor_SMD:C_0201_0603Metric; L1_MAX: 0.5; L1_MIN: 0.1; L1_NOM: 0.3; L_MAX: 0.5; L_MIN: 0.1; L_NOM: 0.3; MANUFACTURER: Samsung Electro-Mechanics; MF: Samsung; MP: CL10C100JB8NNNC; PACKAGE: SMD-2 Samsung; PRICE: None; SNAPEDA_LINK: https://www.snapeda.com/parts/CL10C100JB8NNNC/Samsung/view-part/?ref=snap; STANDARD: IPC 7351B
CR1-CR3 CR6-CR13 = 2025-11-16_12-15-03:SP0402B-ULC-01ETG; DATASHEET: SP0402B-ULC-01ETG; FOOTPRINT: SP0402_LTF
CR4 CR5 = 2025-11-16_16-15-52:LESD5Z5.0CT1G; DATASHEET: LESD5Z5.0CT1G; FOOTPRINT: Diode_SMD:D_SOD-523
D1 = BAT54C-7-F:BAT54C-7-F; AVAILABILITY: In Stock; CHECK_PRICES: https://www.snapeda.com/parts/BAT54C-7-F/Diodes+Inc./view-part/?ref=eda; CREATOR: NEZY; DESCRIPTION_1: Schottky Diode 2x ComCath 0.2A 30V SOT23 | Diodes Inc BAT54C-7-F; FOOTPRINT: Package_TO_SOT_SMD:SOT-23_Handsoldering; MANUFACTURER: Diodes Inc.; MAXIMUM_PACKAGE_HEIGHT: 1.15mm; MF: Diodes Inc.; MP: BAT54C-7-F; PACKAGE: SOT-23 Diodes Inc.; PARTREV: 34-2; PRICE: None; SNAPEDA_LINK: https://www.snapeda.com/parts/BAT54C-7-F/Diodes+Inc./view-part/?ref=snap; STANDARD: IPC-7351B
D2 = APT1608QBC_D:APT1608QBC_D; AVAILABILITY: In Stock; CHECK_PRICES: https://www.snapeda.com/parts/APT1608QBC/D/Kingbright/view-part/?ref=eda; DESCRIPTION_1: Blue 465nm LED Indication - Discrete 3.3V 0603 (1608 Metric); FOOTPRINT: LED_SMD:LED_0201_0603Metric; MANUFACTURER: Kingbright; MAXIMUM_PACKAGE_HEIGHT: 0.75mm; MF: Kingbright; MP: APT1608QBC/D; PACKAGE: 0603 Kingbright; PARTREV: V.20B; PRICE: None; SNAPEDA_LINK: https://www.snapeda.com/parts/APT1608QBC/D/Kingbright/view-part/?ref=snap; STANDARD: Manufacturer Recommendations
FL1-FL3 = MMZ1608Y102BTA00:MMZ1608Y102BTA00; AVAILABILITY: In Stock; CHECK_PRICES: https://www.snapeda.com/parts/MMZ1608Y102BTA00/TDK/view-part/?ref=eda; DESCRIPTION_1: 1 kOhms @ 100 MHz 1 Signal Line Ferrite Bead 0603 (1608 Metric) 400mA 500mOhm; FOOTPRINT: Inductor_SMD:L_0603_1608Metric; MF: TDK; MP: MMZ1608Y102BTA00; PACKAGE: 0603 TDK; PRICE: None; PURCHASE-URL: https://pricing.snapeda.com/search/part/MMZ1608Y102BTA00/?ref=eda; SNAPEDA_LINK: https://www.snapeda.com/parts/MMZ1608Y102BTA00/TDK/view-part/?ref=snap
IC1 = STM32H750VBT6:STM32H750VBT6; ARROW_PART_NUMBER: STM32H750VBT6; ARROW_PRICE_STOCK: https://www.arrow.com/en/products/stm32h750vbt6/stmicroelectronics?utm_currency=USD&region=nac; DATASHEET: https://www.st.com/resource/en/datasheet/stm32h750vb.pdf; DESCRIPTION: ARM Microcontrollers - MCU High-performance and DSP with DP-FPU, Arm Cortex-M7 MCU with 128 Kbytes of Flash memory, 1MB RAM, 400 MHz CPU, L1 cache, external memory interface, JPEG codec, HW crypto, large set of peripherals; FOOTPRINT: Package_QFP:LQFP-100_14x14mm_P0.5mm; HEIGHT: 1.6; MANUFACTURER_NAME: STMicroelectronics; MANUFACTURER_PART_NUMBER: STM32H750VBT6; MOUSER_PART_NUMBER: 511-STM32H750VBT6; MOUSER_PRICE_STOCK: https://www.mouser.co.uk/ProductDetail/STMicroelectronics/STM32H750VBT6?qs=%252BEew9%252B0nqrBAeuu%2FsQQSzQ%3D%3D
J1 = SFV24R-3STBE1HLF:SFV24R-3STBE1HLF; FOOTPRINT: AMPHENOL_SFV24R-3STBE1HLF; MANUFACTURER: Amphenol; MAXIMUM_PACKAGE_HEIGHT: 2.00 mm; PARTREV: A; STANDARD: Manufacturer Recommendations
J2 = Connector:USB_C_RECEPTACLE_USB2.0_16P; DATASHEET: https://www.usb.org/sites/default/files/documents/usb_type-c.zip; DESCRIPTION: USB 2.0-only 16P Type-C Receptacle connector; FOOTPRINT: Connector_USB:USB_C_Receptacle_GCT_USB4110
J3 = Connector:MICRO_SD_CARD_DET_HIROSE_DM3AT; DATASHEET: https://www.hirose.com/product/en/download_file/key_name/DM3/category/Catalog/doc_file_id/49662/?file_category_id=4&item_id=195&is_series=1; DESCRIPTION: Micro SD Card Socket with card detection pins; FOOTPRINT: Connector_Card:microSD_HC_Hirose_DM3AT-SF-PEJM5
J5 = 5051100892:5051100892; AVAILABILITY: In Stock; CHECK_PRICES: https://www.snapeda.com/parts/5051100892/Molex/view-part/?ref=eda; DESCRIPTION_1: 8 Position FFC, FPC Connector Contacts, Bottom 0.020 (0.50mm) Surface Mount, Right Angle; FOOTPRINT: Connector_FFC-FPC:Hirose_FH12-8S-0.5SH_1x08-1MP_P0.50mm_Horizontal; MANUFACTURER_PART_NUMBER: 5051100892; MF: Molex; MFR_NAME: Molex Connector Corporation; MP: 5051100892; PACKAGE: None; PRICE: None; SNAPEDA_LINK: https://www.snapeda.com/parts/5051100892/Molex/view-part/?ref=snap
L1 = SRP4020TA-2R2M:SRP4020TA-2R2M; AVAILABILITY: In Stock; CHECK_PRICES: https://www.snapeda.com/parts/SRP4020TA2R2M/Bourns/view-part/?ref=eda; DESCRIPTION_1: Inductor Power Shielded Wirewound 2.2uH 20% 100KHz 10Q-Factor Carbonyl Powder 4A 0.061Ohm DCR 1616 Automotive T/R; FOOTPRINT: Inductor_SMD:L_Coilcraft_XxL4020; MANUFACTURER: Bourns; MF: Bourns; MP: SRP4020TA2R2M; PACKAGE: None; PRICE: None; SNAPEDA_LINK: https://www.snapeda.com/parts/SRP4020TA2R2M/Bourns/view-part/?ref=snap; STANDARD: Manufacturer Recommendation
L2 = MLZ2012M100W:MLZ2012M100W; AVAILABILITY: In Stock; CHECK_PRICES: https://www.snapeda.com/parts/MLZ2012M100W/TDK/view-part/?ref=eda; DESCRIPTION_1: 10 µH Shielded Multilayer Inductor 350 mA 470mOhm 0805 (2012 Metric); FOOTPRINT: Inductor_SMD:L_0805_2012Metric; MF: TDK; MP: MLZ2012M100W; PACKAGE: 2012 Bourns; PRICE: None; SNAPEDA_LINK: https://www.snapeda.com/parts/MLZ2012M100W/TDK/view-part/?ref=snap
Q1 = Transistor_BJT:MMBT3906; DATASHEET: https://www.onsemi.com/pdf/datasheet/pzt3906-d.pdf; DESCRIPTION: -0.2A Ic, -40V Vce, Small Signal PNP Transistor, SOT-23; FOOTPRINT: Package_TO_SOT_SMD:SOT-23
Q2 = Transistor_BJT:BC857; DATASHEET: https://www.onsemi.com/pub/Collateral/BC860-D.pdf; DESCRIPTION: 0.1A Ic, 45V Vce, PNP Transistor, SOT-23; FOOTPRINT: Package_TO_SOT_SMD:SOT-23
R1-R42 = Device:R; DATASHEET: ~; DESCRIPTION: Resistor; FOOTPRINT: Resistor_SMD:R_0201_0603Metric
SW1-SW3 = Switch:SW_PUSH; DATASHEET: ~; DESCRIPTION: Push button switch, generic, two pins; FOOTPRINT: Button_Switch_SMD:SW_SPST_EVQP7C
U1 = MAX809TEUR_T:MAX809TEUR_T; AVAILABILITY: In Stock; CHECK_PRICES: https://www.snapeda.com/parts/MAX809TEUR+T/Analog+Devices/view-part/?ref=eda; DESCRIPTION_1: 3-Pin Microprocessor Reset Circuits; FOOTPRINT: Package_TO_SOT_SMD:SOT-23-3; MF: Analog Devices; MP: MAX809TEUR+T; PACKAGE: SOT-23-3 Maxim Integrated; PRICE: None; SNAPEDA_LINK: https://www.snapeda.com/parts/MAX809TEUR+T/Analog+Devices/view-part/?ref=snap
U2 = Regulator_Linear:AP2112K-3.3; DATASHEET: https://www.diodes.com/assets/Datasheets/AP2112.pdf; DESCRIPTION: 600mA low dropout linear regulator, with enable pin, 3.8V-6V input voltage range, 3.3V fixed positive output, SOT-23-5; FOOTPRINT: Package_TO_SOT_SMD:SOT-23-5
U3 U7 = 2025-11-18_02-11-13:W25Q64JVSSIQ; DATASHEET: W25Q64JVSSIQ; FOOTPRINT: Package_SO:SOIC-8_3.9x4.9mm_P1.27mm
U4-U6 = PMIC-LDO-XC6206P332MR-G_SOT23_:PMIC-LDO-XC6206P332MR-G_SOT23_; AVAILABILITY: In Stock; CHECK_PRICES: https://www.snapeda.com/parts/XC6206P332MR-G/Torex/view-part/?ref=eda; DESCRIPTION_1: Linear Voltage Regulator IC Positive Fixed 1 Output 200mA SOT-23; FOOTPRINT: Package_TO_SOT_SMD:SOT-23-3; MF: Torex; MP: XC6206P332MR-G; MPN: XC6206P332MR-G; PACKAGE: SOT-23-3 Torex; PRICE: None; SNAPEDA_LINK: https://www.snapeda.com/parts/XC6206P332MR-G/Torex/view-part/?ref=snap; VALUE: XC6206P332MR-G-SOT23
U8 = 2025-11-18_06-15-31:SI2301CDS-T1-GE3; DATASHEET: https://www.vishay.com/doc?68741; FOOTPRINT: Package_TO_SOT_SMD:SOT-23
Y1 = ABS05-32.768KHZ-7-T:ABS05-32.768KHZ-7-T; AVAILABILITY: In Stock; CHECK_PRICES: https://www.snapeda.com/parts/ABS05-32.768KHZ-7-T/Abracon/view-part/?ref=eda; DESCRIPTION_1: Crystal 0.032768MHz ±20ppm (Tol) 7pF FUND 90000Ohm 2-Pin CSMD T/R; FOOTPRINT: Crystal:Crystal_SMD_3215-2Pin_3.2x1.5mm; MANUFACTURER: Abracon; MAXIMUM_PACKAGE_HEIGHT: 0.5 mm; MF: Abracon Corporation; MP: ABS05-32.768KHZ-7-T; PACKAGE: Package; PARTREV: 11/3/2021; PRICE: None; SNAPEDA_LINK: https://www.snapeda.com/parts/ABS05-32.768KHZ-7-T/Abracon/view-part/?ref=snap; STANDARD: Manufacturer Recommendations
Y2 = ABM3-25.000MHZ-D2Y-T:ABM3-25.000MHZ-D2Y-T; AVAILABILITY: In Stock; CHECK_PRICES: https://www.snapeda.com/parts/ABM3-25.000MHZ-D2Y-T/Abracon/view-part/?ref=eda; DESCRIPTION_1: 25 MHz ±20ppm Crystal 18pF 30 Ohms 2-SMD, No Lead; FOOTPRINT: Crystal:Crystal_SMD_3215-2Pin_3.2x1.5mm; MANUFACTURER: Abracon; MAXIMUM_PACKAGE_HEIGHT: 1.3 mm; MF: Abracon; MP: ABM3-25.000MHZ-D2Y-T; PACKAGE: SMD-2 Abracon; PARTREV: 4/25/2022; PRICE: None; SNAPEDA_LINK: https://www.snapeda.com/parts/ABM3-25.000MHZ-D2Y-T/Abracon/view-part/?ref=snap; STANDARD: Manufacturer Recommendations

## Net classes
0 Default: width 0.2 mm, drill 0.3 mm, clearance 0.2 mm